# Altium project CW308T_XMEGA.PrjPcb
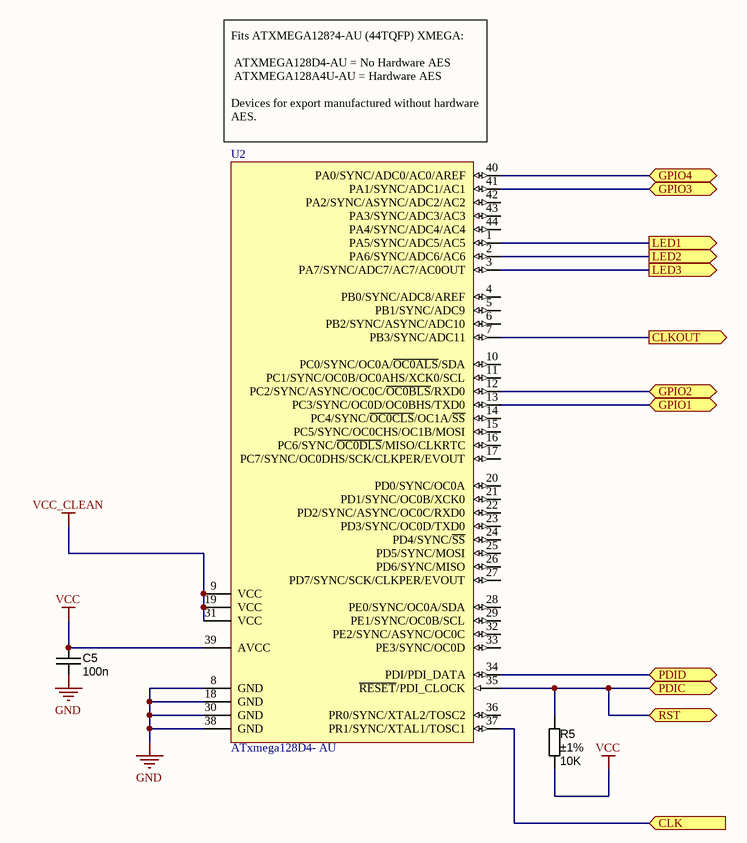
[diagram p0: CW308T_XMEGA_MICRO.SchDoc]
PrjLicense: GPL; PrjName: CW308T-XMEGA; PrjRev: 03
2 sheets, 12 parts. Net scope: flat (ports and power ports of the same name join across sheets).
Board files: CW308T_XMEGA_Panel_st.PcbDoc, CW308T_XMEGA.PcbDoc
Sheets:
  CW308T_XMEGA_MICRO.SchDoc
  CW308T_XMEGA_Connector.SchDoc

## Sheet CW308T_XMEGA_MICRO.SchDoc: XMEGA Microcontroller
size Letter; Organization: NewAE Technology Inc.; Address1: 1083 Queen St., Suite 196; Address2: Halifax; Address3: NS; Address4: Canada B3H 0B2; SheetNumber: 1; SheetTotal: 2; SheetApproved: YES

### Parts
C5  value 100n  [CAPC1608X90N]  (hidden comment: approved sub OK)
R5  value 10K  Tolerance: ±1%  [RESC1608X55N]  (hidden comment: Thick Film)
U2  ATxmega128D4- AU  [44A_M]

### Ports
CLK (in), CLKOUT (out), GPIO1 (bidir), GPIO2 (bidir), GPIO3 (bidir), GPIO4 (bidir), LED1 (out), LED2 (out), LED3 (out), PDIC (bidir), PDID (bidir), RST (bidir)

### Nets
GND: C5.2 U2.8(GND) U2.18(GND) U2.30(GND) U2.38(GND)
VCC: C5.1 R5.1 U2.39(AVCC)  [project net FILTIN]
VCC_CLEAN: U2.9(VCC) U2.19(VCC) U2.31(VCC)  [project net SHUNTL]
GPIO1/TX: U2.13(PC3/SYNC/OC0D/OC0BHS/TXD0) ; port GPIO1
GPIO2/RX: U2.12(PC2/SYNC/ASYNC/OC0C/~{OC0BLS}/RXD0) ; port GPIO2
GPIO3: U2.41(PA1/SYNC/ADC1/AC1) ; port GPIO3
GPIO4/TRIG: U2.40(PA0/SYNC/ADC0/AC0/AREF) ; port GPIO4
HDR1: U2.34(PDI/PDI_DATA) ; port PDID
HDR5: R5.2 U2.35(~{RESET}/PDI_CLOCK) ; port PDIC, port RST
LED1: U2.1(PA5/SYNC/ADC5/AC5) ; port LED1
LED2: U2.2(PA6/SYNC/ADC6/AC6) ; port LED2
LED3: U2.3(PA7/SYNC/ADC7/AC7/AC0OUT) ; port LED3
NetR6_1: U2.37(PR1/SYNC/XTAL1/TOSC1) ; port CLK
NetU2_7: U2.7(PB3/SYNC/ADC11) ; port CLKOUT

Not connected (* = marked no-connect by the designer): U2 4(PB0/SYNC/ADC8/AREF) 5(PB1/SYNC/ADC9) 6(PB2/SYNC/ASYNC/ADC10) 10(PC0/SYNC/OC0A/~{OC0ALS}/SDA) 11(PC1/SYNC/OC0B/OC0AHS/XCK0/SCL) 14(PC4/SYNC/~{OC0CLS}/OC1A/~{SS}) 15(PC5/SYNC/OC0CHS/OC1B/MOSI) 16(PC6/SYNC/~{OC0DLS}/MISO/CLKRTC) 17(PC7/SYNC/OC0DHS/SCK/CLKPER/EVOUT) 20(PD0/SYNC/OC0A) 21(PD1/SYNC/OC0B/XCK0) 22(PD2/SYNC/ASYNC/OC0C/RXD0) 23(PD3/SYNC/OC0D/TXD0) 24(PD4/SYNC/~{SS}) 25(PD5/SYNC/MOSI) 26(PD6/SYNC/MISO) 27(PD7/SYNC/SCK/CLKPER/EVOUT) 28(PE0/SYNC/OC0A/SDA) 29(PE1/SYNC/OC0B/SCL) 32(PE2/SYNC/ASYNC/OC0C) 33(PE3/SYNC/OC0D) 36(PR0/SYNC/XTAL2/TOSC2) 42(PA2/SYNC/ASYNC/ADC2/AC2) 43(PA3/SYNC/ADC3/AC3) 44(PA4/SYNC/ADC4/AC4)

### Notes on the sheet
- (near U2) Fits ATXMEGA128?4-AU (44TQFP) XMEGA:
  ATXMEGA128D4-AU = No Hardware AES
  ATXMEGA128A4U-AU = Hardware AES
  Devices for export manufactured without hardware AES.
- Title:
- Date:
- Rev:
- Time:
- Project:
- Sheet
- of
- License:
- Copyright © NewAE Technology Inc.
- Approved:
- NewAE.com
- File:

### Library data of the parts
C5 = CAPC_100n_0603_X7R_50V_10%: Capacitor SMD Cer 100nF 10% 50V X7R 0603; Manufacturer 1: AVX Corporation; Manufacturer Part Number 1: 06035C104KAT2A; Ratings: 50V; X7R; Material: ceramic; SCDType: spec; Manufacturer 2: TDK Corporation; Manufacturer Part Number 2: C1608X7R1H104K; Package / Case: 0603 (1608 Metric); Tolerance: ±10%; Supplier 1: Digi-Key; Supplier Part Number 1: 478-5052-1-ND; ComponentLink1URL: http://www.avx.com/docs/Catalogs/cx7r.pdf; ComponentLink1Description: http://www.avx.com/docs/Catalogs/cx7r.pdf; Supplier 2: Digi-Key; Supplier Part Number 2: 445-1314-1-ND; ComponentLink2URL: http://product.tdk.com/capacitor/mlcc/en/documents/mlcc_commercial_general_en.pdf; ComponentLink2Description: http://product.tdk.com/capacitor/mlcc/en/documents/mlcc_commercial_general_en.pdf
R5 = RES_10K_0603_1%: Resistor SMD chip 10k Ohm 0.1W 1% 0603; Manufacturer 1: Yageo; Manufacturer Part Number 1: RC0603FR-0710KL; Ratings: 1/10W; SCDType: spec; Package / Case: 0603 (1608 Metric); Supplier 1: Digi-Key; Supplier Part Number 1: 311-10.0KHRCT-ND
U2 = CMP-0094-00044-3: 8/16-bit AVR XMEGA D4 Microcontroller, 1.6-3.6V, 32MHz, 128KB + 8KB Flash, 2KB EEPROM, 8KB SRAM, 44-pin TQFP, Industrial Grade (-40°C to 85°C), Pb-Free; Manufacturer: Atmel; ComponentLink2URL: http://www.atmel.com/Images/Atmel-8135-8-and-16-bit-AVR-microcontroller-ATxmega16D4-32D4-64D4-128D4_datasheet.pdf; RevisionNote: update URL version and symbol Pin7,10,12,14,16,17,27,35,36,37æ”¹åŠ¨; PartNumber: ATxmega128D4- AU; DatasheetVersion: revP, Jan-2014; Code_JEDEC: MS-026-ACB; PackageDescription: 44-Pin Plastic Thin Profile Quad Flat Pack, 10 x 10 x 1.0 mm Body, 0.8 mm Pitch (TQFP); PackageVersion: revC, Oct-2010; ComponentLink1Description: Manufacturer URL; PackageReference: 44A; ComponentLink1URL: http://www.atmel.com/; ComponentLink2Description: Datasheet

## Sheet CW308T_XMEGA_Connector.SchDoc: CW308 Connections
size Letter; Organization: NewAE Technology Inc.; Address1: 1083 Queen St., Suite 196; Address2: Halifax; Address3: NS; Address4: Canada B3H 0B2; SheetNumber: 2; SheetTotal: 2; SheetApproved: YES
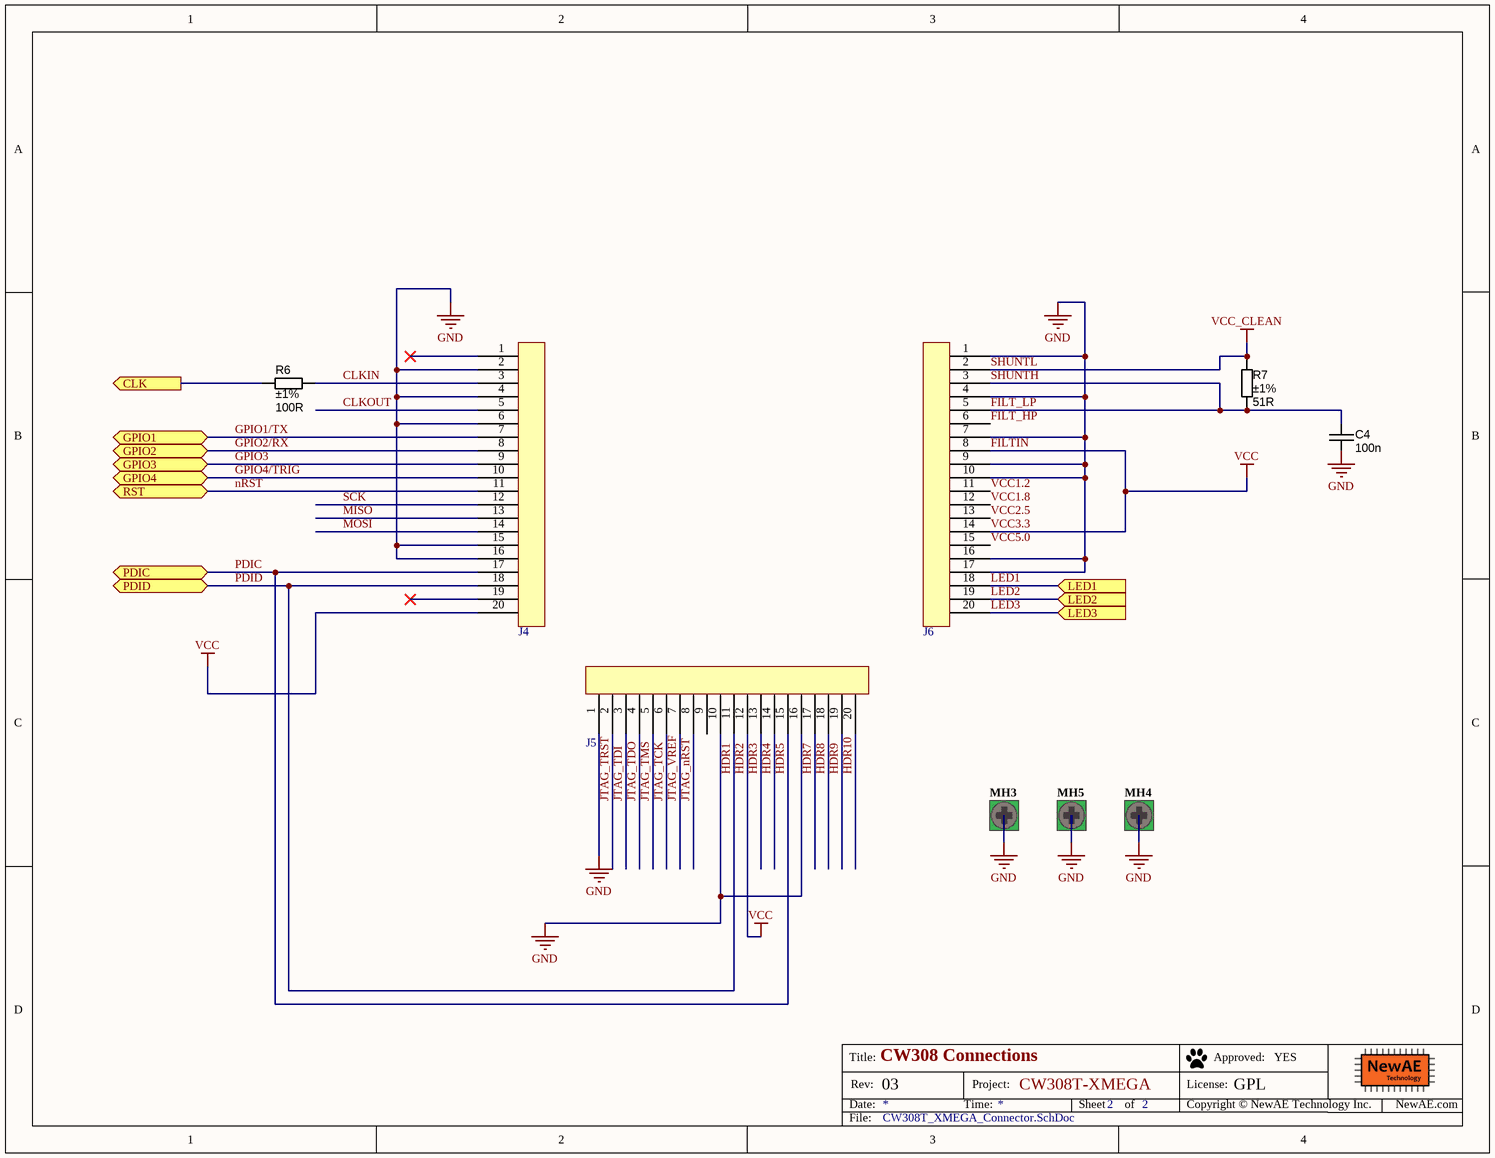
[diagram p1: CW308T_XMEGA_Connector.SchDoc]

### Parts
C4  value 100n  [CAPC1608X90N]  (hidden comment: approved sub OK)
J4  20-Pin Header  [801-87-020-10-001101]  (value not drawn)
J5  20-Pin Header  [801-87-020-10-001101]  (value not drawn)
J6  20-Pin Header  [801-87-020-10-001101]  (value not drawn)
MH3  Mounting-Hole-RND-Altium  [Mounting-Hole-RND-Altium]  (value not drawn)  (no BOM)
MH4  Mounting-Hole-RND-Altium  [Mounting-Hole-RND-Altium]  (value not drawn)  (no BOM)
MH5  Mounting-Hole-RND-Altium  [Mounting-Hole-RND-Altium]  (value not drawn)  (no BOM)
R6  value 100R  Tolerance: ±1%  [RESC1608X55N]  (hidden comment: Thick Film)
R7  value 51R  Tolerance: ±1%  [RESC1608X55N]  (hidden comment: Thick Film)

### Ports
CLK (out), GPIO1 (bidir), GPIO2 (bidir), GPIO3 (bidir), GPIO4 (bidir), LED1 (in), LED2 (in), LED3 (in), PDIC (bidir), PDID (bidir), RST (bidir)

### Nets
FILTIN: J4.20 J5.12 J6.8 J6.14  [also labelled HDR2, VCC, VCC3.3]
GND: C4.2 J4.2 J4.4 J4.6 J4.15 J4.16 J5.1 J5.10 J5.16 J6.1 J6.4 J6.7 J6.9 J6.10 J6.16 J6.17 MH3.1 MH4.1 MH5.1
SHUNTL: J6.2 R7.1  [also labelled VCC_CLEAN]
CLKIN: J4.3 R6.2
CLKOUT: J4.5
FILT_HP: J6.6
FILT_LP: C4.1 J6.3 J6.5 R7.2  [also labelled SHUNTH]
GPIO1/TX: J4.7 ; port GPIO1
GPIO2/RX: J4.8 ; port GPIO2
GPIO3: J4.9 ; port GPIO3
GPIO4/TRIG: J4.10 ; port GPIO4
HDR1: J4.18 J5.11 ; port PDID  [also labelled PDID]
HDR3: J5.13
HDR4: J5.14
HDR5: J4.11 J4.17 J5.15 ; port RST, port PDIC  [also labelled nRST, PDIC]
HDR7: J5.17
HDR8: J5.18
HDR9: J5.19
HDR10: J5.20
JTAG_nRST: J5.8
JTAG_TCK: J5.6
JTAG_TDI: J5.3
JTAG_TDO: J5.4
JTAG_TMS: J5.5
JTAG_TRST: J5.2
JTAG_VREF: J5.7
LED1: J6.18 ; port LED1
LED2: J6.19 ; port LED2
LED3: J6.20 ; port LED3
MISO: J4.13
MOSI: J4.14
SCK: J4.12
VCC1.2: J6.11
VCC1.8: J6.12
VCC2.5: J6.13
VCC5.0: J6.15
NetR6_1: R6.1 ; port CLK

Not connected (* = marked no-connect by the designer): J4 1* 19*; J5 9

### Notes on the sheet
- Title:
- Date:
- Rev:
- Time:
- Project:
- Sheet
- of
- License:
- Copyright © NewAE Technology Inc.
- Approved:
- NewAE.com
- File:

### Library data of the parts
C4 = CAPC_100n_0603_X7R_50V_10%: as C5 on sheet CW308T_XMEGA_MICRO; Manufacturer 2: TDK Corporation; Manufacturer Part Number 2: C1608X7R1H104K; Package / Case: 0603 (1608 Metric); Tolerance: ±10%; Supplier 1: Digi-Key; Supplier Part Number 1: 478-5052-1-ND; ComponentLink1URL: http://www.avx.com/docs/Catalogs/cx7r.pdf; ComponentLink1Description: http://www.avx.com/docs/Catalogs/cx7r.pdf; Supplier 2: Digi-Key; Supplier Part Number 2: 445-1314-1-ND; ComponentLink2URL: http://product.tdk.com/capacitor/mlcc/en/documents/mlcc_commercial_general_en.pdf; ComponentLink2Description: http://product.tdk.com/capacitor/mlcc/en/documents/mlcc_commercial_general_en.pdf
J4-J6 = 801-87-020-10-001101: 1x20 Header, Machined; Manufacture 1: Preci-Dip SA; Manufacture Part Number 1: 801-87-020-10-001101; Supplier 1: Digi-Key; Supplier Part Number 1: 1212-1207-ND
MH3-MH5 = CMP-0001-00029-1: Mounting Hole, Altium, 4.4mm pad, 3.4mm plated hole; Publisher: Altium; ClassName: Mounting Hole
R6 = RES_100R_0603_1%: Resistor SMD chip 100 Ohm 0.1W 1% 0603; Manufacturer 1: Yageo; Manufacturer Part Number 1: RC0603FR-07100RL; Ratings: 1/10 W; SCDType: spec; Package / Case: 0603 (1608 Metric); Material: Thick Film; Supplier 1: Digi-Key; Supplier Part Number 1: 311-100HRCT-ND; Supplier 2: Digi-Key; Supplier Part Number 2: P100HTR-ND; Manufacturer 2: Panasonic - ECG; Manufacturer Part Number 2: ERJ-3EKF1000V; ComponentLink1URL: http://industrial.panasonic.com/www-cgi/jvcr13pz.cgi?E+PZ+3+AOA0002+ERJ3EKF1000V+7+WW; ComponentLink1Description: http://industrial.panasonic.com/www-cgi/jvcr13pz.cgi?E+PZ+3+AOA0002+ERJ3EKF1000V+7+WW
R7 = RES_51R_0603_1%: Resistor SMD chip 51 Ohm 0.1W 1% 0603; Manufacturer 1: Yageo; Manufacturer Part Number 1: RC0603FR-0751RL; Ratings: 1/10 W; SCDType: spec; Package / Case: 0603 (1608 metric); Supplier 1: Digi-Key; Supplier Part Number 1: 311-51.0HRCT-ND; Material: Thick Film

## Nets that join several sheets
FILTIN: CW308T_XMEGA_MICRO (C5.1 R5.1 U2.39), CW308T_XMEGA_Connector (J4.20 J5.12 J6.8 J6.14)
GND: CW308T_XMEGA_MICRO (5 pins), CW308T_XMEGA_Connector (19 pins)
SHUNTL: CW308T_XMEGA_MICRO (U2.9 U2.19 U2.31), CW308T_XMEGA_Connector (J6.2 R7.1)
GPIO1/TX: CW308T_XMEGA_MICRO (U2.13), CW308T_XMEGA_Connector (J4.7)
GPIO2/RX: CW308T_XMEGA_MICRO (U2.12), CW308T_XMEGA_Connector (J4.8)
GPIO3: CW308T_XMEGA_MICRO (U2.41), CW308T_XMEGA_Connector (J4.9)
GPIO4/TRIG: CW308T_XMEGA_MICRO (U2.40), CW308T_XMEGA_Connector (J4.10)
HDR1: CW308T_XMEGA_MICRO (U2.34), CW308T_XMEGA_Connector (J4.18 J5.11)
HDR5: CW308T_XMEGA_MICRO (R5.2 U2.35), CW308T_XMEGA_Connector (J4.11 J4.17 J5.15)
LED1: CW308T_XMEGA_MICRO (U2.1), CW308T_XMEGA_Connector (J6.18)
LED2: CW308T_XMEGA_MICRO (U2.2), CW308T_XMEGA_Connector (J6.19)
LED3: CW308T_XMEGA_MICRO (U2.3), CW308T_XMEGA_Connector (J6.20)
NetR6_1: CW308T_XMEGA_MICRO (U2.37), CW308T_XMEGA_Connector (R6.1)